# EAGLE design H38R00 (EAGLE 9.6.1)
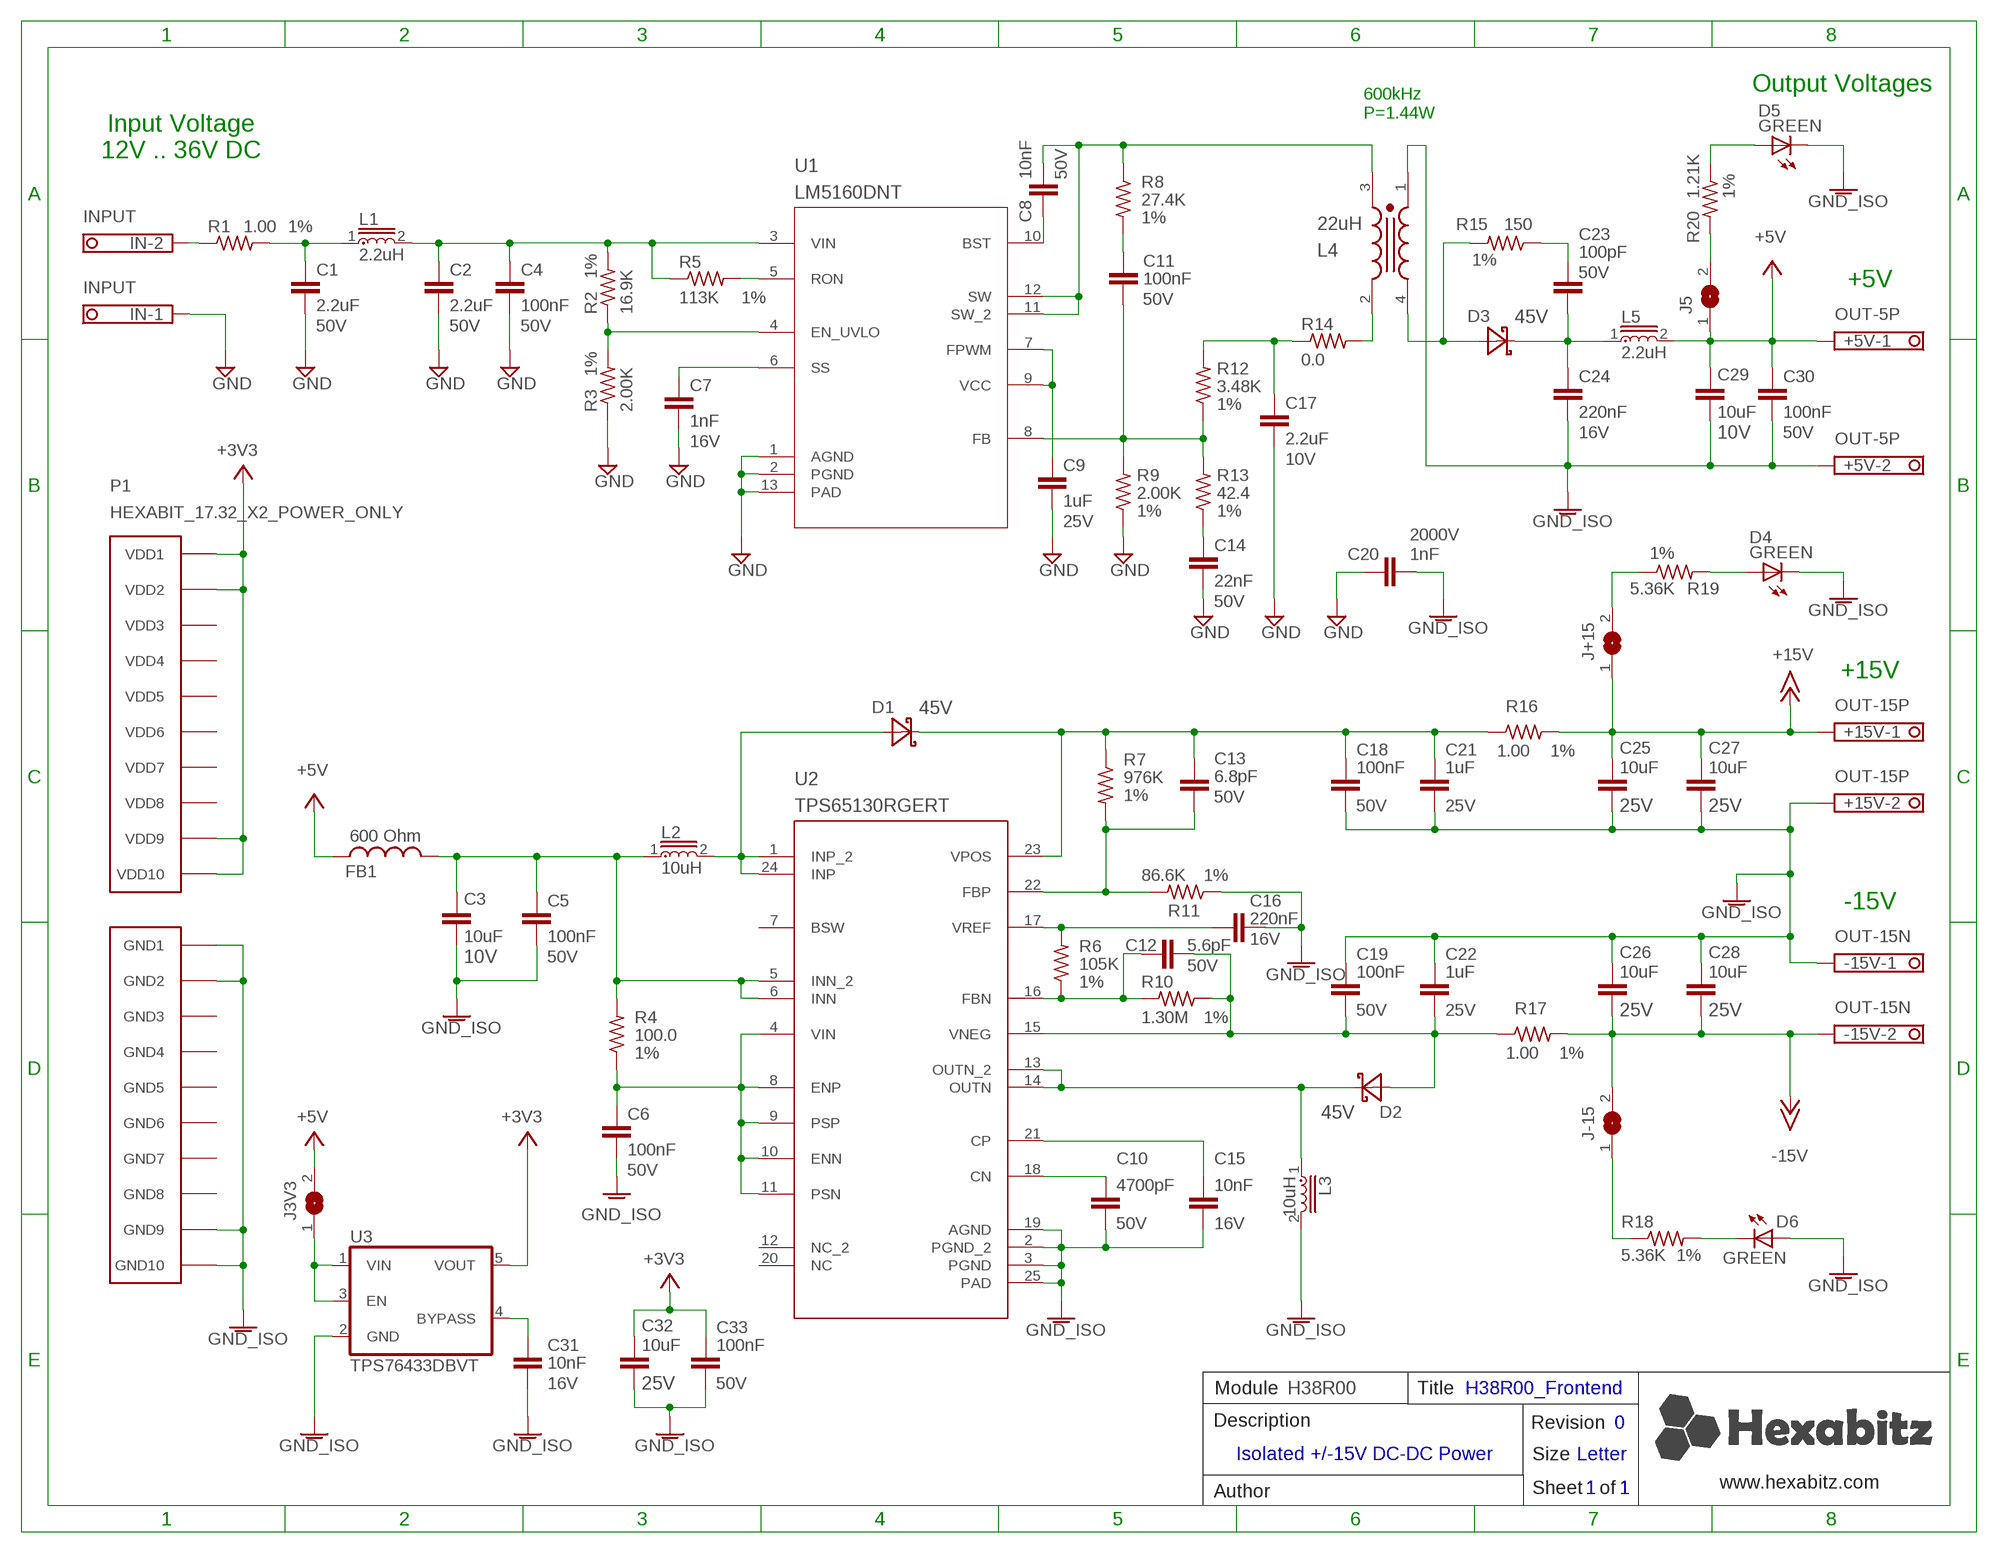
[diagram p0: schematic, sheet 1]

## Parts
+5V  OUT-5P  CON-PHOENIX-350_1751248  [CON-PHOENIX-350_1751248]
+15V  OUT-15P  CON-PHOENIX-350_1751248  [CON-PHOENIX-350_1751248]
-15V  OUT-15N  CON-PHOENIX-350_1751248  [CON-PHOENIX-350_1751248]
C1  2.2uF  C-1206  [C1206K]
C2  2.2uF  C-1206  [C1206K]
C3  10uF  C-0805  [C-0805]
C4  100nF  C-0603  [C-0603]
C5  100nF  C-0603  [C-0603]
C6  100nF  C-0603  [C-0603]
C7  1nF  C-0603  [C-0603]
C8  10nF  C-0603  [C-0603]
C9  1uF  C-0603  [C-0603]
C10  4700pF  C-0603  [C-0603]
C11  100nF  C-0603  [C-0603]
C12  5.6pF  C-0603  [C-0603]
C13  6.8pF  C-0603  [C-0603]
C14  22nF  C-0603  [C-0603]
C15  10nF  C-0603  [C-0603]
C16  220nF  C-0603  [C-0603]
C17  2.2uF  C-0603  [C-0603]
C18  100nF  C-0603  [C-0603]
C19  100nF  C-0603  [C-0603]
C20  1nF  C-1206  [C1206K]
C21  1uF  C-0603  [C-0603]
C22  1uF  C-0603  [C-0603]
C23  100pF  C-0603  [C-0603]
C24  220nF  C-0603  [C-0603]
C25  10uF  C-0805  [C-0805]
C26  10uF  C-0805  [C-0805]
C27  10uF  C-0805  [C-0805]
C28  10uF  C-0805  [C-0805]
C29  10uF  C-0805  [C-0805]
C30  100nF  C-0603  [C-0603]
C31  10nF  C-0603  [C-0603]
C32  10uF  C-0805  [C-0805]
C33  100nF  C-0603  [C-0603]
D1  DIOD-SOD-123  [SOD123]
D2  DIOD-SOD-123  [SOD123]
D3  DIOD-SOD-123  [SOD123]
D4  GREEN  VLMTG1300-GS08  [VLMS1300-GS08]
D5  GREEN  VLMTG1300-GS08  [VLMS1300-GS08]
D6  GREEN  VLMTG1300-GS08  [VLMS1300-GS08]
FB1  600 Ohm  FB-0603  [FB-0603]
IN  INPUT  CON-PHOENIX-350_1751248  [CON-PHOENIX-350_1751248]
J3V3  SJ  [SJ]
J5  SJ  [SJ]
J+15  SJ  [SJ]
J-15  SJ  [SJ]
L1  2.2uH  LQM18PN2R2MFHD  [C-0603]
L2  10uH  WUERTH_ELEKTRONIK_74404024100WUERTH_ELEKTRONIK_74404024100_0_0  [WUERTH_ELEKTRONIK_74404024100_0]
L3  10uH  WUERTH_ELEKTRONIK_74404024100WUERTH_ELEKTRONIK_74404024100_0_0  [WUERTH_ELEKTRONIK_74404024100_0]
L4  22uH  WUERTH_ELEKTRONIK_74489430220WUERTH_ELEKTRONIK_74489430220_0_0  [WUERTH_ELEKTRONIK_74489430220_0]
L5  2.2uH  LQM18PN2R2MFHD  [C-0603]
P1  HEXABIT_17.32_X2_POWER_ONLY  [HEXABIT_17.32_X2_POWER_ONLY]
R1  1.00  R-0603  [R-0603]
R2  16.9K  R-0603  [R-0603]
R3  2.00K  R-0603  [R-0603]
R4  100.0  R-0603  [R-0603]
R5  113K  R-0603  [R-0603]
R6  105K  R-0603  [R-0603]
R7  976K  R-0603  [R-0603]
R8  27.4K  R-0603  [R-0603]
R9  2.00K  R-0603  [R-0603]
R10  1.30M  R-0603  [R-0603]
R11  86.6K  R-0603  [R-0603]
R12  3.48K  R-0603  [R-0603]
R13  42.4  R-0603  [R-0603]
R14  0.0  R-0603  [R-0603]
R15  150  R-0603  [R-0603]
R16  1.00  R-0603  [R-0603]
R17  1.00  R-0603  [R-0603]
R18  5.36K  R-0603  [R-0603]
R19  5.36K  R-0603  [R-0603]
R20  1.21K  R-0603  [R-0603]
U1  LM5160DNT  [DNT0012B]
U2  TPS65130RGERT  [RGE0024B_NV]
U3  TPS76433DBVT  [SOT25]

## Nets
+3V3: C32.1 C33.1 P1.PAD_PU11(VDD1) P1.PAD_PU12(VDD2) P1.PAD_PU19(VDD9) P1.PAD_PU20(VDD10) U3.5(VOUT)
+5V: +5V.1 C29.1 C30.1 FB1.1 J3V3.2 J5.1 L5.2
+15V: +15V.1 C25.1 C27.1 J+15.1 R16.2
-15V: -15V.2 C26.2 C28.2 J-15.2 R17.2
GND: C1.2 C2.2 C4.2 C7.2 C9.2 C14.2 C17.2 C20.1 IN.1 R3.1 R9.1 U1.1(AGND) U1.2(PGND) U1.13(PAD)
IGND: +5V.2 +15V.2 -15V.1 C3.2 C5.2 C6.2 C10.2 C15.2 C16.2 C18.2 C19.1 C20.2 C21.2 C22.1 C24.2 C25.2 C26.1 C27.2 C28.1 C29.2 C30.2 C31.2 C32.2 C33.2 D4.C D5.C D6.A L3.2 L4.1 P1.PAD_PD11(GND1) P1.PAD_PD12(GND2) P1.PAD_PD19(GND9) P1.PAD_PD20(GND10) R11.1 U2.2(PGND_2) U2.3(PGND) U2.19(AGND) U2.25(PAD) U3.2(GND) ; supply symbol labelled GND_ISO
N$1: IN.2 R1.1
N$2: C1.1 L1.1 R1.2
N$3: C2.1 C4.1 L1.2 R2.2 R5.1 U1.3(VIN)
N$4: R5.2 U1.5(RON)
N$5: R2.1 R3.2 U1.4(EN_UVLO)
N$6: C7.1 U1.6(SS)
N$7: C8.2 L4.3 R8.1 U1.11(SW_2) U1.12(SW)
N$8: C8.1 U1.10(BST)
N$9: C9.1 U1.7(FPWM) U1.9(VCC)
N$10: C11.2 R9.2 R12.1 R13.2 U1.8(FB)
N$11: C11.1 R8.2
N$12: C17.1 R12.2 R14.1
N$13: L4.2 R14.2
N$14: C14.1 R13.1
N$15: C23.2 C24.1 D3.2(C) L5.1
N$16: D3.1(A) L4.4 R15.2
N$17: C23.1 R15.1
N$18: C3.1 C5.1 FB1.2 L2.1 R4.2 U2.5(INN_2) U2.6(INN)
N$19: J5.2 R20.2
N$20: D5.A R20.1
N$21: D1.1(A) L2.2 U2.1(INP_2) U2.24(INP)
N$22: C13.2 C18.1 C21.1 D1.2(C) R7.1 R16.1 U2.23(VPOS)
N$23: C6.1 R4.1 U2.4(VIN) U2.8(ENP) U2.9(PSP) U2.10(ENN) U2.11(PSN)
N$24: C10.1 U2.18(CN)
N$25: C15.1 U2.21(CP)
N$26: D2.2(C) L3.1 U2.13(OUTN_2) U2.14(OUTN)
N$27: C12.2 C19.2 C22.2 D2.1(A) R10.1 R17.1 U2.15(VNEG)
N$28: C12.1 R6.1 R10.2 U2.16(FBN)
N$29: C16.1 R6.2 U2.17(VREF)
N$30: C13.1 R7.2 R11.2 U2.22(FBP)
N$31: J+15.2 R19.1
N$32: D4.A R19.2
N$33: J-15.1 R18.1
N$34: D6.C R18.2
N$35: C31.1 U3.4(BYPASS)
N$36: J3V3.1 U3.1(VIN) U3.3(EN)
Unconnected: U2.7(BSW) U2.12(NC_2) U2.20(NC)

## Notes on the sheet
- Output Voltages
- 600kHz
  P=1.44W
- Input Voltage
  12V .. 36V DC
- +5V
- +15V
- -15V
- Module | H38R00 | Title | H38R00_Frontend
- Description | Revision | 0
- Isolated +/-15V DC-DC Power
- Size | Letter
- www.hexabitz.com
- Author | Sheet   of | 1 | 1
- C:/Users/Admin/Desktop/logodraft.bmp

## Power pins joined to a net without a drawn wire
GND3: P1.PAD_PD13(GND3)
GND4: P1.PAD_PD14(GND4)
GND5: P1.PAD_PD15(GND5)
GND6: P1.PAD_PD16(GND6)
GND7: P1.PAD_PD17(GND7)
GND8: P1.PAD_PD18(GND8)
VDD3: P1.PAD_PU13(VDD3)
VDD4: P1.PAD_PU14(VDD4)
VDD5: P1.PAD_PU15(VDD5)
VDD6: P1.PAD_PU16(VDD6)
VDD7: P1.PAD_PU17(VDD7)
VDD8: P1.PAD_PU18(VDD8)

## Library data of the parts
+5V +15V -15V IN = Hexabitz:CON-PHOENIX-350_1751248: 2pin Terminal Block; Printed Circuit; 10 A; 160 V; 3.5 mm; 2; 3.5 mm; 1.2 mm; M2; PA; MFN: Phoenix Contact; MPN: 1751251; OCTOPART_URL: https://octopart.com/1751251-phoenix+contact-36473?r=sp&s=9M0VWNoHTyq04j3qI6lQOQ; OC_FARNELL: unknown; OC_NEWARK: unknown
C1 C2 = Hexabitz:C-1206: Cap Tant Solid SMD 1206; CAPACITANCE: 2.2uF; MFN: Taiyo Yuden; MPN: UMK316B7225KD-T; OCTOPART_URL: https://octopart.com/umk316b7225kd-t-taiyo+yuden-22313261?r=sp&s=B2pE5EchQ-uXrqiEc-TSGg; VOLTAGE: 50V
C3 C29 = Hexabitz:C-0805: CAP CER 10% X7R 0805; CAPACITANCE: 10uF; MFN: Würth Elektronik; MPN: 885012207026; OCTOPART_URL: https://octopart.com/885012207026-w%C3%BCrth+elektronik-65419800?r=sp&s=PJ8-ZxRrRL-RXf1D2e7V7w; TOLERANCE: 10%; VOLTAGE_RATING: 10V
C4-C6 C11 C18 C19 C30 C33 = Hexabitz:C-0603: CAP CER 10% X7R 0603; CAPACITANCE: 100nF; MFN: TDK; MPN: C1608X7R1H104K; OCTOPART_URL: https://octopart.com/c1608x7r1h104k080aa-tdk-25947665?r=sp&s=vJ3_28x5RGekN18MBHqpKw; TOLERANCE: 10%; VOLTAGE_RATING: 50V
C7 = Hexabitz:C-0603: CAP CER 10% X7R 0603; CAPACITANCE: 1nF; MFN: Würth Elektronik; MPN: 885012206034; OCTOPART_URL: https://octopart.com/885012206034-w%C3%BCrth+elektronik-53914743?r=sp&s=3y92xzxLSKK6IudBxcGU8w; TOLERANCE: 10%; VOLTAGE_RATING: 16V
C8 = Hexabitz:C-0603: CAP CER 10% X7R 0603; CAPACITANCE: 10nF; MFN: KEMET; MPN: C0603C103J5RACTU; OCTOPART_URL: https://octopart.com/c0603c103j5ractu-kemet-91371?r=sp&s=Kyc2xDn-SuWGmNLJldLSIQ; TOLERANCE: 10%; VOLTAGE_RATING: 50V
C9 C21 C22 = Hexabitz:C-0603: CAP CER 10% X7R 0603; CAPACITANCE: 1uF; MFN: Taiyo Yuden; MPN: TMK107B7105KA-T; OCTOPART_URL: https://octopart.com/tmk107b7105ka-t-taiyo+yuden-20363789?r=sp&s=C0MvDSixSxq0oU7K_M5ppQ; TOLERANCE: 10%; VOLTAGE_RATING: 25V
C10 = Hexabitz:C-0603: CAP CER 10% X7R 0603; CAPACITANCE: 4700pF; MFN: Würth Elektronik; MPN: 885012206087; OCTOPART_URL: https://octopart.com/885012206087-w%C3%BCrth+elektronik-53914796?r=sp&s=1K2nhhCgSUq-KN0bvB69Uw; TOLERANCE: 10%; VOLTAGE_RATING: 50V
C12 = Hexabitz:C-0603: CAP CER 10% X7R 0603; CAPACITANCE: 5.6pF; MFN: TDK; MPN: 06035A5R6CAT2A; OCTOPART_URL: https://octopart.com/06035a5r6cat2a-avx-194782?r=sp&s=arSRmqwrS2KePu_erVaGmg; TOLERANCE: 5%; VOLTAGE_RATING: 50V
C13 = Hexabitz:C-0603: CAP CER 10% X7R 0603; CAPACITANCE: 6.8pF; MFN: AVX; MPN: 06035A6R8CAT2A; OCTOPART_URL: https://octopart.com/06035a6r8cat2a-avx-194783?r=sp&s=5-5NBtM6RDWLTSW9K30eVg; TOLERANCE: 10%; VOLTAGE_RATING: 50V
C14 = Hexabitz:C-0603: CAP CER 10% X7R 0603; CAPACITANCE: 22nF; MFN: Murata; MPN: GRM188R71H223KA01D; OCTOPART_URL: https://octopart.com/grm188r71h223ka01d-murata-196232?r=sp&s=t23e6pi9S5yo9EHFMT_EKg; TOLERANCE: 10%; VOLTAGE_RATING: 50V
C15 C31 = Hexabitz:C-0603: CAP CER 10% X7R 0603; CAPACITANCE: 10nF; MFN: Würth Elektronik; MPN: 885012206040; OCTOPART_URL: https://octopart.com/885012206040-w%C3%BCrth+elektronik-53914749?r=sp&s=G3_ezLbARM2-FohtMFECqg; TOLERANCE: 10%; VOLTAGE_RATING: 16V
C16 C24 = Hexabitz:C-0603: CAP CER 10% X7R 0603; CAPACITANCE: 220nF; MFN: Würth Elektronik; MPN: 885012206048; OCTOPART_URL: https://octopart.com/885012206048-w%C3%BCrth+elektronik-53914757?r=sp&s=r2jVh1M7TTWSNtdrsMd35A; TOLERANCE: 10%; VOLTAGE_RATING: 16V
C17 = Hexabitz:C-0603: CAP CER 10% X7R 0603; CAPACITANCE: 2.2uF; MFN: Murata; MPN: GRM188R71A225KE15D; OCTOPART_URL: https://octopart.com/grm188r71a225ke15d-murata-197889?r=sp&s=UhC5vs9xSQGkDEPPXrg6Ig; TOLERANCE: 10%; VOLTAGE_RATING: 10V
C20 = Hexabitz:C-1206: Cap Tant Solid SMD 1206; CAPACITANCE: 1nF; MFN: Johanson; MPN: 202R18W102KV4E; OCTOPART_URL: https://octopart.com/202r18w102kv4e-johanson-2172376?r=sp&s=IMqDAiaaSSy_LnEOeR4maQ; VOLTAGE: 2000V
C23 = Hexabitz:C-0603: CAP CER 10% X7R 0603; CAPACITANCE: 100pF; MFN: KEMET; MPN: C0603C101J5GACTU; OCTOPART_URL: https://octopart.com/c0603c101j5gactu-kemet-100052?r=sp&s=G9Wafbc2Rs-t41DcITu08w; TOLERANCE: 5%; VOLTAGE_RATING: 50V
C25-C28 C32 = Hexabitz:C-0805: CAP CER 10% X7R 0805; CAPACITANCE: 10uF; MFN: Murata; MPN: GRM21BC71E106KE11L; OCTOPART_URL: https://octopart.com/grm21bc71e106ke11l-murata-51454492?r=sp&s=2Vde2RpCRyqy5YYMvYke3Q; TOLERANCE: 10%; VOLTAGE_RATING: 25V
D1-D3 = Hexabitz:DIOD-SOD-123: 1.0 A Surface Mount Schottky Barrier Rectifier, 40 V, -65 to 125 degC, 2-Pin SOD-123 Package, RoHS, Tape and Reel; CURRENT: 2A; MFN: ON Semiconductor; MPN: NTS245SFT1G; OCTOPART_URL: https://octopart.com/nts245sft1g-on+semiconductor-53638116?r=sp&s=Zo8Z59f0QcynsgZ2PtBRwg; VOLTAGE_RATING_DC: 45V
D4-D6 = Hexabitz:VLMTG1300-GS08: LED Uni-Color Green 530nm 2-Pin Chip 0603(1608Metric) T/R; MFN: Vishay; MPN: VLMTG1300-GS08; OCTOPART_URL: https://octopart.com/vlmtg1300-gs08-vishay-21709202
FB1 = Hexabitz:FB-0603: Ferrite Beads Multi-Layer 0603; MFN: Murata; MPN: BLM18KG601SN1D; OCTOPART_URL: https://octopart.com/blm18kg601sn1d-murata-12276433?r=sp&s=hc41AUOpRWisdZqqWWZOxA
J3V3 J5 J+15 J-15 = jumper:SJ: SMD solder JUMPER
L1 L5 = Hexabitz:LQM18PN2R2MFHD: Inductor Power Chip Shielded Multi-Layer 2.2uH 20% 1MHz Ferrite 0.7A 0.475Ohm DCR 0603 T/R; MFN: Murata; MPN: LQM18PN2R2MFHD; OCTOPART_URL: https://octopart.com/lqm18pn2r2mfhd-murata-46921411?r=sp&s=Row_twtqSIqtu2tUWXcF8g#
L2 L3 = Hexabitz:WUERTH_ELEKTRONIK_74404024100: Inductor, Wirewound, Ferrite, 10 μH, 0.47 A, 0.435 ohm, SMD; CIIVA_IDS: 19365520; COMPONENT_LINK_1_DESCRIPTION: Manufacturer URL; COMPONENT_LINK_1_URL: http://www.we-online.com; DATASHEET: http://katalog.we-online.de/pbs/datasheet/74404024100.pdf; FOOTPRINT_VARIANT_NAME_0: Manufacturer Recommended; IMPORTED: yes; IMPORTED_FROM: vault; IMPORT_TS: 1521847971; INDUCTANCE: 10.0 ÂμH; MF: Wuerth Elektronik; MFN: Wuerth Elektronik; MPN: 74404024100; OCTOPART_URL: https://octopart.com/74404024100-w%C3%BCrth+elektronik-46948232?r=sp&s=xErvwIUSShuUNbZJf5Tacg#CadModels; PACKAGE: WE-LQS 252012; PREFIX: L; RELEASE_DATE: 1421136684; VAULT_GUID: 14C676CA-5921-489C-B22D-D02530F94C47; VAULT_REVISION: 1C5BE5AF-1DED-48F4-87F1-C018B46CE48A
L4 = Hexabitz:WUERTH_ELEKTRONIK_74489430220: Coupled inductor, 22 μH, 1.1 A, 0.48 ohm, SMD; CIIVA_IDS: 906613; COMPONENT_LINK_1_DESCRIPTION: Manufacturer URL; COMPONENT_LINK_1_URL: http://www.we-online.com; DATASHEET: http://katalog.we-online.de/pbs/datasheet/74489430220.pdf; FOOTPRINT_VARIANT_NAME_0: Manufacturer Recommended; IMPORTED: yes; IMPORTED_FROM: vault; IMPORT_TS: 1521847487; INDUCTANCE: 22.0 ÂμH; MF: Wuerth Elektronik; MFN: Wuerth Elektronik; MPN: 74489430220; OCTOPART_URL: https://octopart.com/74489430220-w%C3%BCrth+elektronik-19122490?r=sp&s=sZgvZhVdRiOvXPP3ZHNQng#; PACKAGE: WE-TDC 8018; PREFIX: L; RELEASE_DATE: 1421213019; VAULT_GUID: DC7281E7-2FA0-48B8-8A08-9B1522AF1AC9; VAULT_REVISION: AD34EA21-00F0-458B-A44F-F680A14C5CDA
P1 = hexabitz_connectors:HEXABIT_?_X2_POWER_ONLY: Hexabitz Double Hexagon Power-Only Module Connector Hexagon side length = 17.32mm.
R1 R16 R17 = Hexabitz:R-0603: Thick Film Resistors - SMD 0603; MFN: Vishay-Dale; MPN: CRCW06031R00FKEA; OCTOPART_URL: https://octopart.com/crcw06031r00fkea-vishay-39713722?r=sp&s=biXSlGylTBiwPOCcABx_kA; RESISTANCE: 1.00; TOLERANCE: 1%
R2 = Hexabitz:R-0603: Thick Film Resistors - SMD 0603; MFN: Vishay; MPN: CRCW060316K9FKEA; OCTOPART_URL: https://octopart.com/crcw060316k9fkea-vishay-39809405?r=sp&s=gpyoC5sESS275Bx1L_ovfA; RESISTANCE: 16.9K; TOLERANCE: 1%
R3 R9 = Hexabitz:R-0603: Thick Film Resistors - SMD 0603; MFN: Vishay; MPN: CRCW06032K00FKEA; OCTOPART_URL: https://octopart.com/crcw06032k00fkea-vishay-39455515?r=sp&s=oLMBsKnqSyiGxb37P4YGRQ; RESISTANCE: 2.00k; TOLERANCE: 1%
R4 = Hexabitz:R-0603: Thick Film Resistors - SMD 0603; MFN: Vishay; MPN: CRCW0603100RFKEA; OCTOPART_URL: https://octopart.com/crcw0603100rfkea-vishay-39454046?r=sp&s=ZCLXy-8WTNaYdj0NMUzO0A; RESISTANCE: 100.0; TOLERANCE: 1%
R5 = Hexabitz:R-0603: Thick Film Resistors - SMD 0603; MFN: Vishay; MPN: CRCW0603113KFKEA; OCTOPART_URL: https://octopart.com/crcw0603113kfkea-vishay-39817257?r=sp&s=CTaWAi24RJSm7_6d5HDAcw; RESISTANCE: 113K; TOLERANCE: 1%
R6 = Hexabitz:R-0603: Thick Film Resistors - SMD 0603; MFN: Vishay; MPN: CRCW0603105KFKEA; OCTOPART_URL: https://octopart.com/crcw0603105kfkea-vishay-39783419?r=sp&s=m57LqOW9SZi8auMTWgZAuA; RESISTANCE: 105K; TOLERANCE: 1%
R7 = Hexabitz:R-0603: Thick Film Resistors - SMD 0603; MFN: Vishay; MPN: CRCW0603976KFKEA; OCTOPART_URL: https://octopart.com/crcw0603976kfkea-vishay-39847458?r=sp&s=cUxC9lyxRzee74EppCoygA; RESISTANCE: 976K; TOLERANCE: 1%
R8 = Hexabitz:R-0603: Thick Film Resistors - SMD 0603; MFN: Vishay; MPN: CRCW060327K4FKEA; OCTOPART_URL: https://octopart.com/crcw060327k4fkea-vishay-40950191?r=sp&s=-sh_flwyTnabpVfO2SO3MQ; RESISTANCE: 27.4K; TOLERANCE: 1%
R10 = Hexabitz:R-0603: Thick Film Resistors - SMD 0603; MFN: Vishay; MPN: CRCW06031M30FKEA; OCTOPART_URL: https://octopart.com/crcw06031m30fkea-vishay-39601140?r=sp&s=IFmbrVO2QdmVcSmXO7E1AA; RESISTANCE: 1.30M; TOLERANCE: 1%
R11 = Hexabitz:R-0603: Thick Film Resistors - SMD 0603; MFN: Vishay; MPN: CRCW060386K6FKEA; OCTOPART_URL: https://octopart.com/crcw060386k6fkea-vishay-39809057?r=sp&s=kiKKot43Sa6nkjOnoApb7Q; RESISTANCE: 86.6K; TOLERANCE: 1%
R12 = Hexabitz:R-0603: Thick Film Resistors - SMD 0603; MFN: Vishay; MPN: CRCW06033K48FKEA; OCTOPART_URL: https://octopart.com/crcw06033k48fkea-vishay-39806638?r=sp&s=N5g7S2AyTDmMWBX-_wGc6Q; RESISTANCE: 3.48K; TOLERANCE: 1%
R13 = Hexabitz:R-0603: Thick Film Resistors - SMD 0603; MFN: Vishay; MPN: CRCW060342R2FKEA; OCTOPART_URL: https://octopart.com/crcw060342r2fkea-vishay-39808977?r=sp&s=-XoBdwS-TmODK1i1WGs3Gw; RESISTANCE: 42.2R; TOLERANCE: 1%
R14 = Hexabitz:R-0603: Thick Film Resistors - SMD 0603; MFN: Panasonic; MPN: ERJ-3GEY0R00V; OCTOPART_URL: https://octopart.com/erj-3gey0r00v-panasonic-55389238?r=sp&s=8dmrTZyCS32IAujh55Hh-g; RESISTANCE: 0.0R; TOLERANCE: 5%
R15 = Hexabitz:R-0603: Thick Film Resistors - SMD 0603; MFN: Vishay; MPN: CRCW0603150RFKEA; OCTOPART_URL: https://octopart.com/crcw0603150rfkea-vishay-39455211?r=sp&s=fhZ4fTqDSW-fVK_X4mehlA; RESISTANCE: 150R; TOLERANCE: 1%
R18 R19 = Hexabitz:R-0603: Thick Film Resistors - SMD 0603; MFN: Vishay; MPN: CRCW06035K36FKEA; OCTOPART_URL: https://octopart.com/crcw06035k36fkea-vishay-39850082?r=sp&s=UzQdyXKeQlK-zUZHNwTiSQ; RESISTANCE: 5.36K; TOLERANCE: 1%
R20 = Hexabitz:R-0603: Thick Film Resistors - SMD 0603; MFN: Vishay; MPN: CRCW06031K21FKEA; OCTOPART_URL: https://octopart.com/crcw06031k21fkea-vishay-39455541?r=sp&s=DmmN7huOS0CziwVau3vt0g; RESISTANCE: 1.21K; TOLERANCE: 1%
U1 = Hexabitz:LM5160DNT: LM5160 wide input 65V, 2A synchronous buck/Fly-Buck™ converter 12-WSON -40 to 125; COMPTYPE: IC; MANUFACTURER: Texas Instruments; MFN: Texas Instruments; MOUNTTYPE: SMT; MPN: LM5160DNT; OCTOPART_URL: https://octopart.com/lm5160dntt-texas+instruments-51761725?r=sp&s=sYhYnlaHQIStkk-s71hgUg; PACKAGEREFERENCE: DNT0012B; PARTNUMBER: LM5160DNT; PIN_COUNT: 13; REFDES: RefDes; ROHS: Y; TYPE: TYPE
U2 = Hexabitz:TPS65130RGER: Split-Rail Converter with Dual, Positive and Negative Outputs (300mA typ) 24-VQFN -40 to 85; ALTERNATE_PARTNUMBER: TPS65130RGET; APPLICATION_BUILDNUMBER: *; COMPTYPE: IC; MANUFACTURER: Texas Instruments; MFN: Texas Instruments; MOUNTTYPE: SMT; MPN: TPS65130RGET; OCTOPART_URL: https://octopart.com/tps65130rget-texas+instruments-7102173?r=sp&s=1oanP9AbQhOs522rlI3BXw; PACKAGEREFERENCE: RGE0024B; PARTNUMBER: TPS65130RGER; PIN_COUNT: 25; REFDES: RefDes; ROHS: Y; TYPE: TYPE
U3 = Hexabitz:TPS764: 150mA Low Noise LDO Voltage Regulator with Enable; MFN: Texas Instruments; MPN: TPS76433DBVT; OCTOPART_URL: https://octopart.com/tps76433dbvt-texas+instruments-69873?r=sp&s=0aHKKhMLSUCTmmqJkhwwIQ

## Board
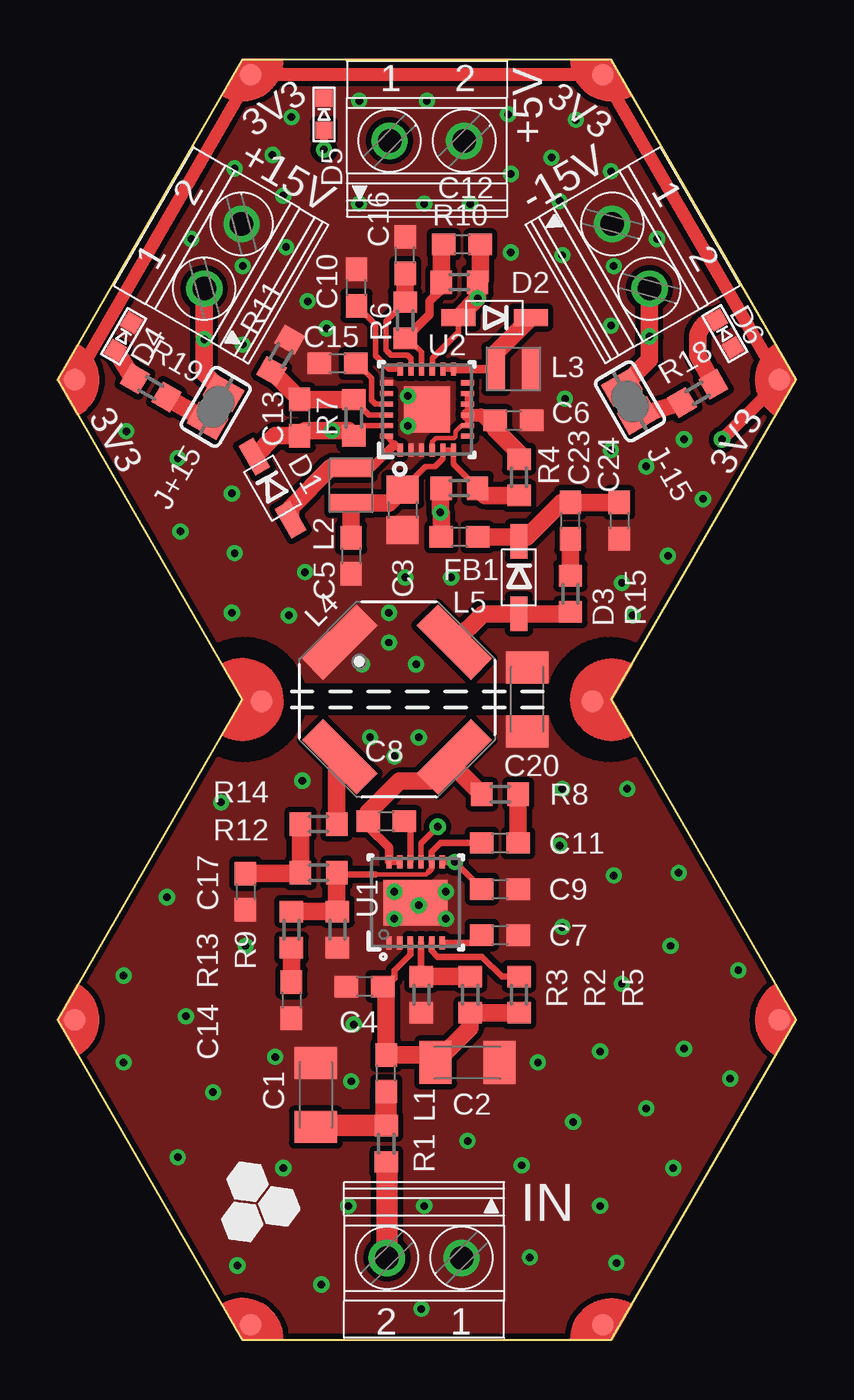
[diagram p1: board, top side]
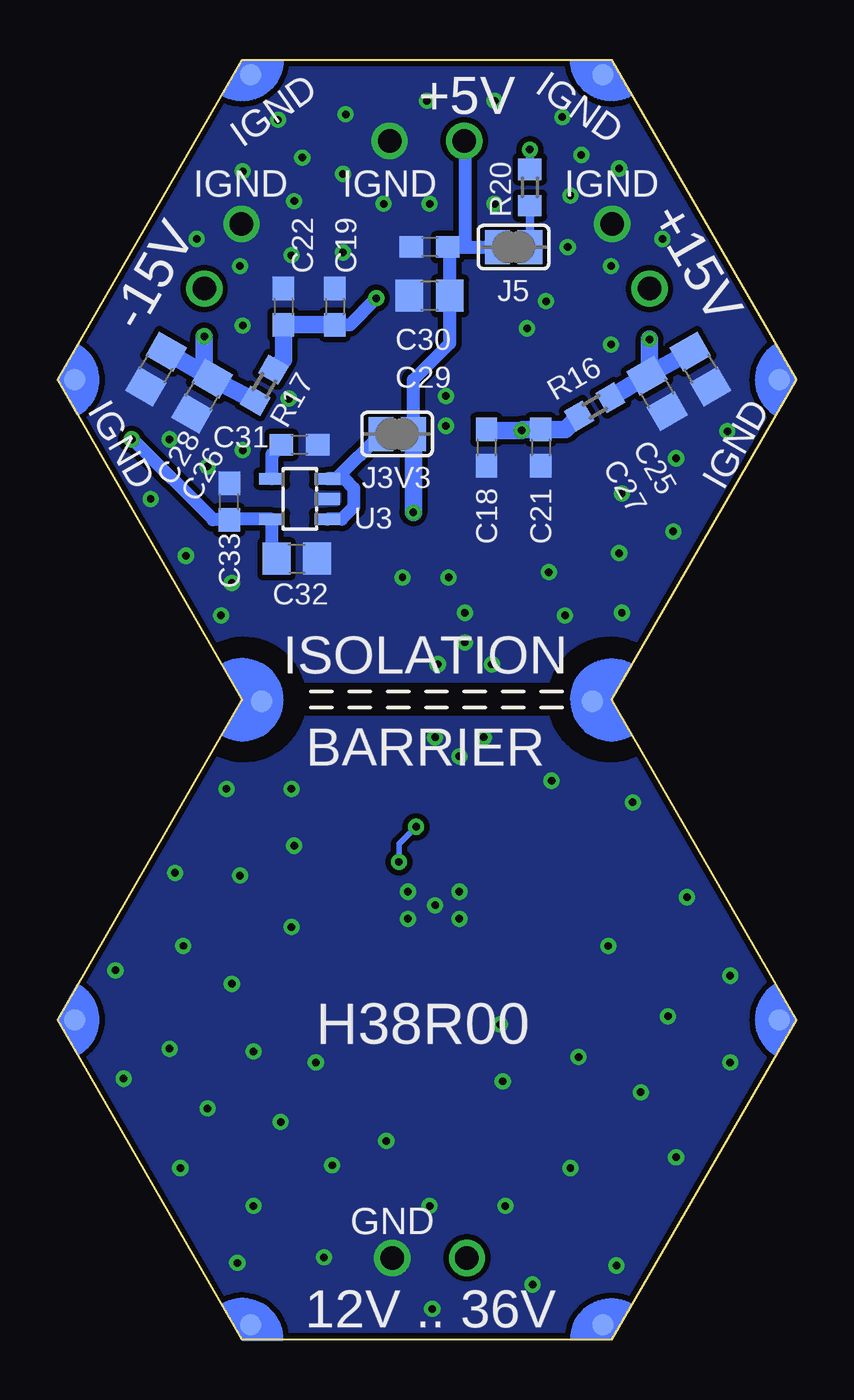
[diagram p2: board, bottom side, seen from below]

Size 34.64 x 60 mm. Coordinates in mm from the lower left corner, seen from the top.
Copper layers (1*16): Top 0.035mm / dielectric 1.5mm / Bottom 0.035mm
Design rules "2_layer": minimum track width 7mil, minimum drill 10mil, track to track 6mil, track to pad 6mil, pad to pad 6mil, via to via 6mil, smd to smd 0mil, copper to edge 1mil, drill to drill 8mil, minimum pad ring 10mil, minimum via ring 8mil, stop-mask expansion 2mil, vias tented up to drill 15mil, thermal gap 10mil
tRestrict: 2 lines
bRestrict: 2 lines

### Footprints (pad centres in the part's own frame; a part is rotated, then mirrored left to right if it is on the bottom)
CON-PHOENIX-350_1751248 = drill 1.1 pad 1.7: 1 -1.75,-0.1; 2 1.75,-0.1
C1206K = smd 1.5 x 2: 1 -1.5,0; 2 1.5,0
C-0805 = smd 1.3 x 1.5: 1 -0.95,0; 2 0.95,0
C-0603 = smd 1.1 x 1: 1 -0.85,0; 2 0.85,0
SOD123 = smd 1.6 x 0.8: 1 -1.7,0; 2 1.7,0
VLMS1300-GS08 = smd 0.8 x 0.8: A 0,0.75; C 0,-0.75
FB-0603 = smd 1 x 1.1: 1 -0.85,0; 2 0.85,0
SJ = smd 1.168 x 1.6: 1 -0.762,0; 2 0.762,0
WUERTH_ELEKTRONIK_74404024100_0 = smd 0.85 x 2: 1 -0.825,0; 2 0.825,0
WUERTH_ELEKTRONIK_74489430220_0 = smd 3.6 x 1.4: 1 0,3.8; 3 0,-3.8 | smd 1.4 x 3.6: 2 -3.8,0; 4 3.8,0
HEXABIT_17.32_X2_POWER_ONLY = smd 1 x 1 rotated 60 bottom: PAD_PD11 8.26,14.307 | smd 1 x 1 bottom: PAD_PD12 16.52,0; PAD_PD13 7.752,-15.072; PAD_PD14 16.52,-30; PAD_PD15 8.26,-44.31; PAD_PD16 -8.26,-44.31; PAD_PD17 -16.52,-30; PAD_PD18 -7.752,-15.072; PAD_PD19 -16.52,0 | smd 1 x 1 rotated 120 bottom: PAD_PD20 -8.26,14.307 | smd 1 x 1 rotated 60: PAD_PU11 8.26,14.307 | smd 1 x 1: PAD_PU12 16.52,0; PAD_PU13 7.752,-15.072; PAD_PU14 16.52,-30; PAD_PU15 8.26,-44.31; PAD_PU16 -8.26,-44.31; PAD_PU17 -16.52,-30; PAD_PU18 -7.752,-15.072; PAD_PU19 -16.52,0 | smd 1 x 1 rotated 120: PAD_PU20 -8.26,14.307
R-0603 = smd 1 x 1.1: 1 -0.85,0; 2 0.85,0
DNT0012B = smd 0.6 x 0.25: 1 -1.9,1.25; 2 -1.9,0.75; 3 -1.9,0.25; 4 -1.9,-0.25; 5 -1.9,-0.75; 6 -1.9,-1.25; 7 1.9,-1.25; 8 1.9,-0.75; 9 1.9,-0.25; 10 1.9,0.25; 11 1.9,0.75; 12 1.9,1.25 | smd 2.134 x 3: 13 0,0
RGE0024B_NV = smd 0.6 x 0.24: 1 -1.9,1.25; 2 -1.9,0.75; 3 -1.9,0.25; 4 -1.9,-0.25; 5 -1.9,-0.75; 6 -1.9,-1.25; 13 1.9,-1.25; 14 1.9,-0.75; 15 1.9,-0.25; 16 1.9,0.25; 17 1.9,0.75; 18 1.9,1.25 | smd 0.24 x 0.6: 7 -1.25,-1.9; 8 -0.75,-1.9; 9 -0.25,-1.9; 10 0.25,-1.9; 11 0.75,-1.9; 12 1.25,-1.9; 19 1.25,1.9; 20 0.75,1.9; 21 0.25,1.9; 22 -0.25,1.9; 23 -0.75,1.9; 24 -1.25,1.9 | smd 2.159 x 2.159: 25 0,0
SOT25 = smd 0.55 x 1.2: 1 -0.95,-1.3; 2 0,-1.3; 3 0.95,-1.3; 4 0.95,1.3; 5 -0.95,1.3

### Placement (x,y rotation side)
+5V  17.32,56.3 0 top
+15V  7.67,50.84 60 top
-15V  26.97,50.84 300 top
C1  12.11,11.47 90 top
C2  19.22,13 0 top
C3  16.18,38.9 270 top
C4  14.4,16.55 180 top
C5  13.76,36.74 270 top
C6  21.38,43.09 0 top
C7  20.75,18.96 0 top
C8  15.41,24.3 180 top
C9  20.75,21.12 0 top
C10  14.02,49.32 90 top
C11  20.75,23.28 180 top
C12  18.97,51.35 0 top
C13  11.35,43.22 270 top
C14  10.97,15.92 270 top
C15  13.13,45.76 180 top
C16  16.3,50.84 90 top
C17  8.81,21 270 top
C18  14.53,41.82 270 bottom
C19  21.64,48.43 270 bottom
C20  22.02,30.01 90 top
C21  11.99,41.82 270 bottom
C22  24.05,48.43 270 bottom
C23  24.05,38.4 90 top
C24  26.34,38.4 270 top
C25  4.49,45.51 300 bottom
C26  27.86,44.24 60 bottom
C27  6.52,44.36 300 bottom
C28  30.02,45.51 60 bottom
C29  17.19,48.94 180 bottom
C30  17.19,51.22 180 bottom
C31  23.29,41.95 0 bottom
C32  23.42,36.62 0 bottom
C33  26.59,39.28 90 bottom
D1  10.08,39.92 120 top
D2  20.49,47.92 0 top
D3  21.64,35.73 90 top
D4  3.1,47.03 150 top
D5  12.49,57.45 180 top
D6  31.29,47.16 210 top
FB1  18.84,39.92 0 top
IN  17.19,3.72 180 top
J3V3  18.72,42.46 0 bottom
J5  13.26,51.22 0 bottom
J+15  7.41,43.73 240 top
J-15  26.84,43.98 120 top
L1  15.41,12.49 90 top
L2  13.76,40.05 90 top
L3  21.38,45.51 0 top
L4  15.92,30.01 45 top
L5  18.84,37.63 180 top
P1  17.32,45 0 top
R1  15.41,9.19 90 top
R2  19.35,16.17 270 top
R3  17.07,16.17 90 top
R4  21.64,40.43 270 top
R5  21.64,16.17 90 top
R6  16.3,47.79 90 top
R7  13.89,43.22 90 top
R8  20.75,25.57 0 top
R9  13.13,19.22 90 top
R10  18.84,49.57 180 top
R11  10.46,46.14 240 top
R12  12.24,21.89 180 top
R13  10.97,19.22 90 top
R14  12.24,24.17 0 top
R15  24.05,34.97 270 top
R16  9.45,43.73 30 bottom
R17  24.94,44.75 240 bottom
R18  30.02,44.36 30 top
R19  4.37,44.62 150 top
R20  12.49,54.02 270 bottom
U1  16.79,20.49 90 top
U2  17.32,43.6 90 top
U3  23.29,39.41 90 bottom

### Tracks (layer width: path | path; a pad name or v marks a point on that pad's centre or on a via)
+3V3  (via drill 0.35)
  Top 0.61: v31.16,42.21 33.84,44.88 P1.PAD_PU12 P1.PAD_PU11 13.34,59.31 11.65,59.31 P1.PAD_PU20 P1.PAD_PU19
  Bottom 0.61: C32.1 24.59,36.84 U3.5 26.56,38.46 C33.1 27.35,38.43 31.12,42.21 v31.16,42.21
+5V  (via drill 0.35)
  Top 0.813: L5.2 17.99,38.74 v17.95,38.78 17.95,39.88 FB1.1
  Bottom 0.61: J3V3.2 17.95,45 16.24,46.71 C29.1 16.24,51.12 C30.1 15.54,51.22 | 15.54,51.22 J5.1 | +5V.1 15.54,56.17 15.54,51.22
  Bottom 0.813: J3V3.2 v17.95,38.78
+15V  (via drill 0.35)
  Top 0.813: J+15.1 6.88,45.3 v6.88,46.91 +15V.1
  Bottom 0.813: C25.1 C27.1 | C27.1 R16.2 | C27.1 6.88,45.31 v6.88,46.91
-15V  (via drill 0.35)
  Top 0.813: J-15.2 27.76,45.94 v27.76,47.03 -15V.2
  Bottom 0.813: R17.2 C26.2 | C26.2 C28.2 | C26.2 arc90 27.76,45.43 v27.76,47.03
GND  (via drill 0.35)
  other vias: 14.65,28.24 15.8,27.35 16.94,28.24 26.72,25.82 29.13,21.89 5.13,20.74 7.67,25.19 31.92,17.31 3.1,13 3.1,17.06 5.64,8.55 8.43,3.47 26.08,21.76 28.75,18.46 26.46,16.68 23.67,19.35 23.67,25.82 23.54,23.16 22.15,3.85 26.21,3.6 28.88,8.04 31.54,12.23 27.61,10.84 25.45,6.26 29.38,13.63 24.18,10.2 21.77,8.17 25.45,13.5 22.53,13 19.22,9.31 11.48,26.2 8.81,18.46 6.02,15.15 10.21,13.25 13.64,6.26 12.37,2.58 17.07,1.44 17.19,6.26 13.76,12.11 7.29,11.6 13.89,14.77 15.8,21 18.21,21 18.21,19.73 15.8,19.73 16.94,20.36 10.59,8.04
  pour Bottom (isolate 0.254, no thermals): 8.61,-0.02 25.93,-0.02 34.59,14.98 26.37,29.21 8.17,29.21 -0.05,14.98
  pour Top (isolate 0.254, no thermals): 8.61,-0.02 25.93,-0.02 34.59,14.98 26.37,29.21 8.17,29.21 -0.05,14.98
IGND  (via drill 0.35)
  other vias: 8.3,54.91 10.08,55.54 10.97,57.32 21.26,54.65 19.35,53.25 17.19,53.25 14.14,53.25 6.27,51.6 10.59,53.64 10.72,51.22 11.73,48.68 12.62,47.41 8.68,46.65 3.22,42.59 5.76,37.89 8.18,34.08 10.84,33.95 11.6,35.98 8.3,36.87 8.18,39.67 5.64,41.32 14.27,31.66 15.54,32.68 16.81,31.66 15.54,34.08 16.3,35.73 18.46,35.73 26.97,33.95 26.46,35.47 28.62,36.74 30.27,39.41 27.61,40.94 25.96,41.7 29.38,42.21 21.26,50.97 23.67,50.84 25.96,47.54 28.11,51.6 23.54,53.38 23.16,55.41 25.96,54.78 24.3,57.19 21.13,57.45 17.32,58.08 14.14,58.08 23.8,44.11 8.68,50.33 26.08,50.33 16.43,42.84 16.43,44.24
  pour Top (isolate 0.254, no thermals): 8.1,30.84 26.44,30.84 34.59,44.95 25.93,59.95 8.61,59.95 -0.05,44.95
  pour Bottom (isolate 0.254, no thermals): 8.1,30.84 26.44,30.84 34.59,44.95 25.93,59.95 8.61,59.95 -0.05,44.95
N$1
  Top 1.016: IN.2 15.44,8.31 R1.1
N$2
  Top 1.016: L1.1 R1.2 12.18,10.04 C1.1
N$3
  Top 0.305: U1.3 16.54,18.06 15.8,17.31 15.8,16.93 15.41,16.55 C4.1
  Top 0.813: R5.1 R2.2 19.35,14.62 C2.1 17.38,13.34 L1.2 15.41,16.39 C4.1
N$4
  Top 0.305: U1.5 17.54,18.23 17.83,17.95 19.9,17.95 20.83,17.02 R5.2
N$5
  Top 0.305: U1.4 17.04,17.04 R3.2
  Top 0.813: R3.2 R2.1
N$6
  Top 0.305: U1.6 19.53,18.59 C7.1
N$7
  Top 0.305: U1.11 U1.12
  Top 0.406: C8.2 14.56,24.04 15.54,23.07 U1.12
  Top 0.813: 18.19,27.33 L4.3 | C8.2 14.56,24.72 16.03,26.18 17.47,26.18 L4.3 | L4.3 18.61,26.86 R8.1
N$8
  Top 0.305: U1.10 16.54,24.02 C8.1
N$9  (via drill 0.35)
  Top 0.254: U1.9 17.04,23.26 v17.83,24.04
  Top 0.305: U1.7 v18.63,22.39 C9.1
  Bottom 0.254: v17.83,24.04 18.63,23.24 v18.63,22.39
N$10
  Top 0.203: 17.38,21.92 17.28,21.81 14.91,21.81
  Top 0.254: U1.8 17.54,22.07 17.38,21.92
  Top 0.305: U1.8 17.54,22.87 17.95,23.28 C11.2 | 14.91,21.81 13.16,21.81 R12.1
  Top 0.813: R13.2 R9.2 13.09,20.11 R12.1
N$11
  Top 0.813: R8.2 C11.1
N$12
  Top 0.813: C17.1 11.35,21.85 R12.2 R14.1
N$13
  Top 0.813: R14.2 13.09,27.18 L4.2
N$14
  Top 0.813: R13.1 C14.1
N$15
  Top 0.813: L5.1 21.43,37.63 | 21.43,37.63 D3.2 | 21.43,37.63 22.02,37.63 23.63,39.25 C23.2 C24.1
N$16
  Top 0.813: L4.4 19.94,34.03 D3.1 23.96,34.03 R15.2
N$17
  Top 0.813: C23.1 R15.1
N$18
  Top 0.254: C3.1 17.26,40.94 17.7,40.94 18.08,41.32 18.08,41.69 U2.5 U2.6 18.57,41.04 FB1.2
  Top 0.813: C5.1 L2.1 15.54,39.22 C3.1 | FB1.2 20.04,39.58 R4.2
N$19
  Bottom 0.406: J5.2 R20.2
N$20  (via drill 0.35)
  Top 0.406: v12.49,55.8 D5.A
  Bottom 0.406: R20.1 v12.49,55.8
N$21
  Top 0.254: U2.24 15.81,41.96 U2.1
  Top 0.406: 15.81,41.96 14.72,40.87 L2.2
  Top 0.813: L2.2 12.81,40.87 10.93,38.99 D1.1
N$22  (via drill 0.35)
  Top 0.254: U2.23 14.37,42.85 R7.1
  Top 0.813: D1.2 10.21,42.37 C13.2 11.6,42.63 v12.87,42.63 13.64,42.63 R7.1
  Bottom 0.813: R16.1 10.81,42.67 C21.1 12.83,42.67 v12.87,42.63 14.48,42.63 C18.1
N$23
  Top 0.203: U2.8 18.94,42.85 18.67,42.58 18.67,42.33 18.59,42.26 17.95,42.26 17.75,42.26 17.57,42.07 U2.4
  Top 0.254: U2.11 U2.10 U2.9 U2.8
  Top 0.61: U2.9 19.86,43.35 20.53,42.67
  Top 0.813: R4.1 21.64,41.57 20.53,42.67 C6.1
N$24
  Top 0.254: U2.18 15.55,45.5 14.91,46.14 14.91,47.58 C10.1
N$25
  Top 0.254: U2.21 14.91,43.85 14.72,44.04 14.72,45.07 14.03,45.76 C15.1
N$26
  Top 0.254: U2.14 U2.13
  Top 0.406: U2.13 L3.1
  Top 0.813: L3.1 20.56,46.28 D2.2
N$27  (via drill 0.35)
  Top 0.254: U2.15 17.57,46.02 18.79,47.24 D2.1
  Top 0.813: D2.1 v19.69,48.82 R10.1 19.82,49.7 C12.2
  Bottom 0.61: C19.2 20.93,47.58 v19.69,48.82
  Bottom 0.813: C19.2 C22.2 24.05,45.95 R17.1
N$28
  Top 0.254: R6.1 16.43,46.94 17.07,46.3 U2.16
  Top 0.406: R6.1 16.34,46.94 17.45,48.05 17.45,48.68 17.99,49.23 R10.2
  Top 0.813: C12.1 17.99,51.22 R10.2
N$29
  Top 0.254: U2.17 16.57,46 16.41,46.16 15.64,46.16 15.47,46.33 15.47,46.34 15.41,46.4 15.41,47.75 R6.2
  Top 0.813: R6.2 C16.1
N$30
  Top 0.254: U2.22 14.61,43.35 R7.2
  Top 0.813: R7.2 C13.1 11.35,44.09 R11.2
N$31
  Top 0.813: R19.1 J+15.2
N$32
  Top 0.813: R19.2 3.37,45.3 D4.A
N$33
  Top 0.813: J-15.1 R18.1
N$34
  Top 0.813: R18.2 30.02,46.14 30.02,46.91 arc-90 D6.C
N$35
  Bottom 0.61: U3.4 24.59,41.5 C31.1
N$36
  Bottom 0.61: J3V3.1 21.58,40.36 U3.3 21.19,40.36 20.75,39.92 20.75,39.03 21.32,38.46 U3.1

### Text on the board
tPlace: 3V3 | 3V3 | 3V3 | 3V3
bPlace: IGND | +5V | IGND | IGND | IGND | IGND | +15V | -15V | IGND | IGND | ISOLATION | BARRIER | H38R00 | GND | 12V .. 36V